# Altium schematic sheet 1_Sheet_1 copy.schdoc
size 302 x 215 mm; Name: A_A4; Symbol: A_A4; Device: A_A4; @Project Name: BackupProjects_chlehmann_personal_0_20260513; REV: 1.0; Date: 2026-05-11; Sheet: 1/1; Draw By: chlehmann; Company: Your Company; Convert to PCB: yes; Add into BOM: yes; spicePre: .; @Page No: 1; @Page Count: 2; @Schematic Name: Klettie_2026 Pro; @Board Name: Klettie_2026 Pro; @Update Date: 2026-05-13; @Create Time: 10:46:50; @Update Time: 19:20:12; @Page Name: Sheet_1 copy; @Create Date: 2026-05-13
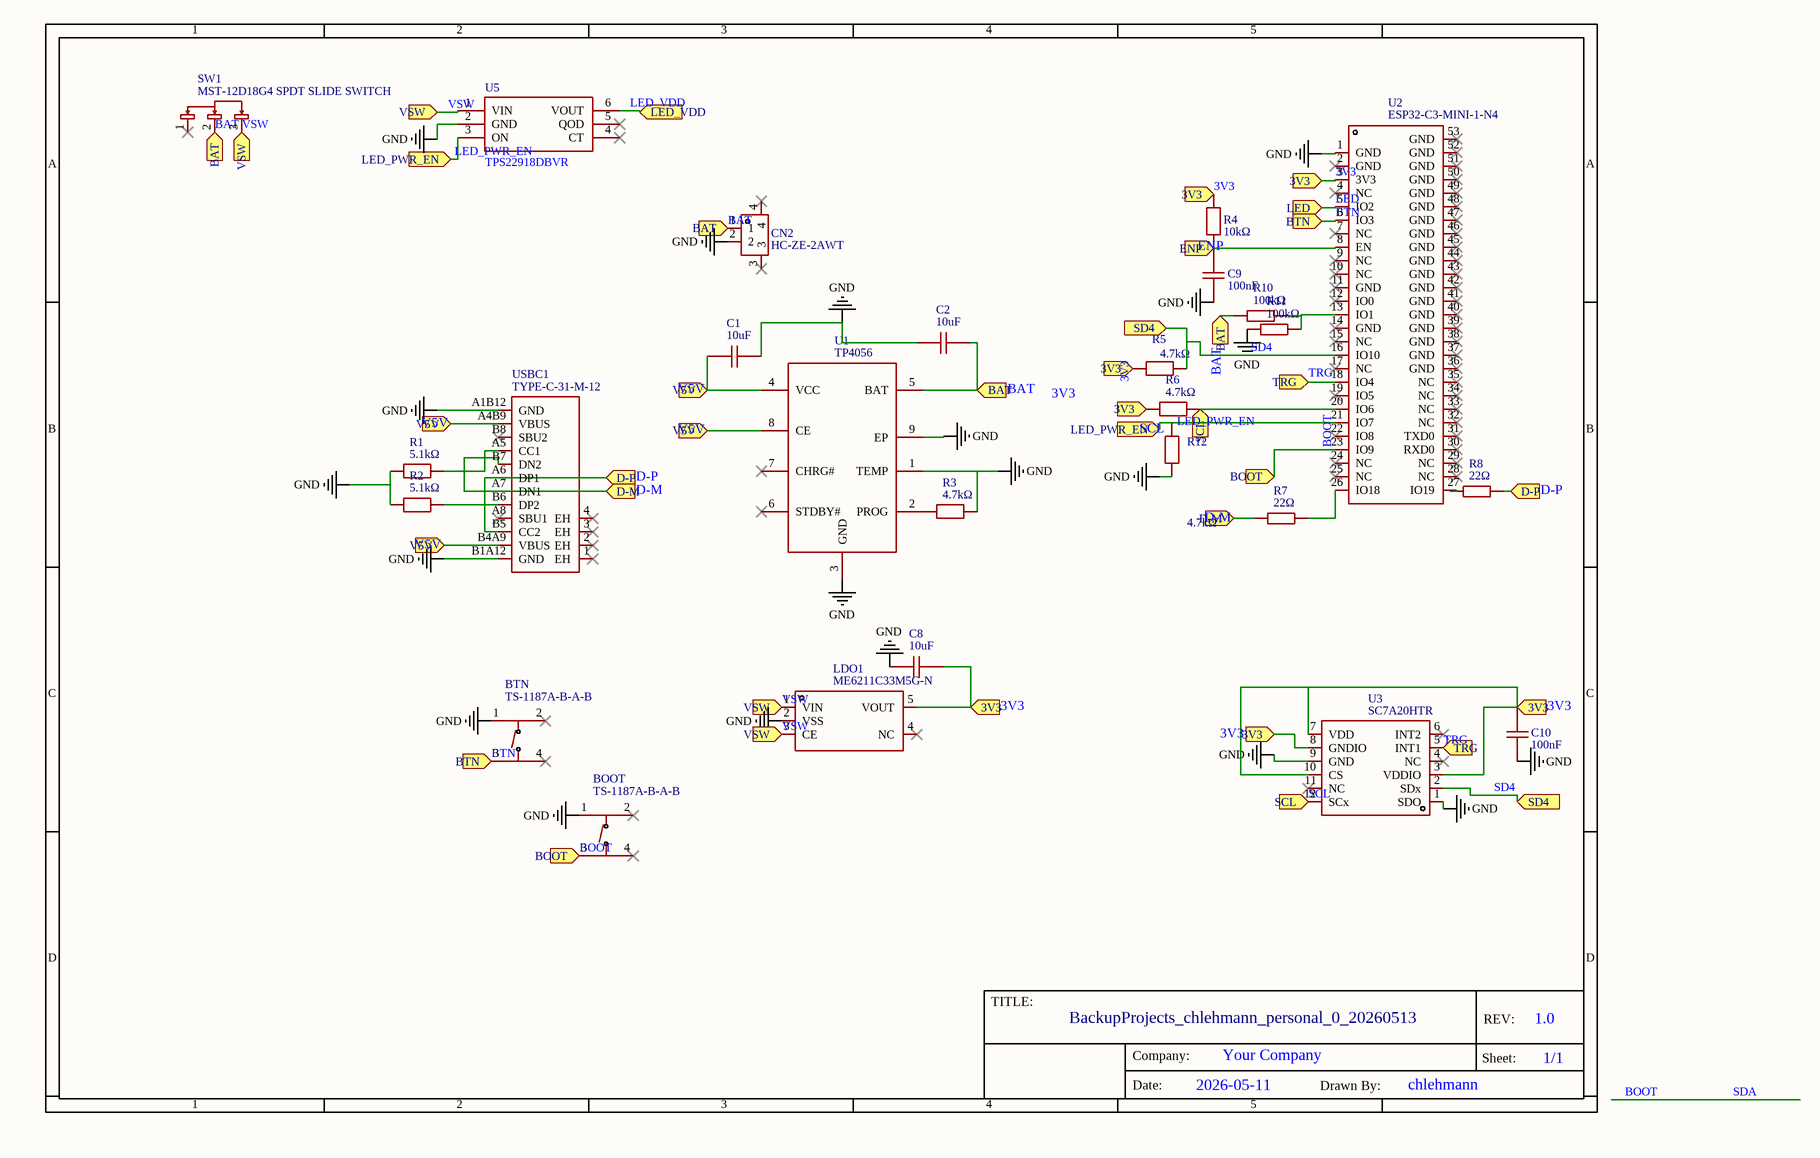
[diagram p0: 1_Sheet_1 copy.schdoc]

## Parts
BOOT  TS-1187A-B-A-B  [SW-SMD_4P-L5.1-W5.1-P3.70-LS6.5-TL_H1.5]
BTN  TS-1187A-B-A-B  [SW-SMD_4P-L5.1-W5.1-P3.70-LS6.5-TL_H1.5]
C1  10uF  [C0603]
C2  10uF  [C0603]
C8  10uF  [C0603]
C9  100nF  [C0603]
C10  100nF  [C0603]
CN2  HC-ZE-2AWT  [CONN-SMD_2P-P1.50_JST_SM02B-ZESS-TB]
LDO1  ME6211C33M5G-N  [SOT-23-5_L3.0-W1.7-P0.95-LS2.8-BL]
R1  5.1kΩ  [R0603]
R2  5.1kΩ  [R0603]
R3  4.7kΩ  [R0603]
R4  10kΩ  [R0603]
R5  4.7kΩ  [R0603]
R6  4.7kΩ  [R0603]
R7  22Ω  [R0603]
R8  22Ω  [R0603]
R10  100kΩ  [R0603]
R11  100kΩ  [R0603]
R12  4.7kΩ  [R0603]
SW1  MST-12D18G4 SPDT SLIDE SWITCH  [SW-SMD_MST-12D18G4-SPDT-SLIDE-SWITCH]
U1  TP4056  [ESOP-8_L4.9-W3.9-P1.27-LS6.0-BL-EP]
U2  ESP32-C3-MINI-1-N4  [WIFIM-SMD_ESP32-C3-MINI-1]
U3  SC7A20HTR  [LGA-12_L2.0-W2.0-P0.50-TL]
U5  TPS22918DBVR  [SOT-23-6_L2.9-W1.6-P0.95-LS2.8-BR]
USBC1  TYPE-C-31-M-12  [USB-C_SMD-TYPE-C-31-M-12_1]

## Ports
3V3 (in), BAT (in), BOOT (in), BTN (in), D-M (in), D-P (in), ENP (in), LED (in), LED_PWR_EN (in), LED_VDD (in), SCL (in), SD4 (in), TRG (in), V5V (in), VSW (in)

## Nets
GND: BOOT.1(A) BTN.1(A) C1.2 C2.1 C8.1 C9.1 C10.1 CN2.2 LDO1.2(VSS) R1.1 R2.1 R3.2 R11.1 R12.1 U1.1(TEMP) U1.3(GND) U1.9(EP) U2.1(GND) U3.1(SDO) U3.9(GND) U5.2(GND) USBC1.A1B12(GND) USBC1.B1A12(GND)
3V3: C8.2 C10.2 LDO1.5(VOUT) R4.2 R5.1 R6.1 U2.3(3V3) U3.3(VDDIO) U3.7(VDD) U3.8(GNDIO) U3.10(CS) ; port 3V3
BAT: C2.2 CN2.1 R10.1 SW1.2 U1.5(BAT) ; port BAT
BOOT: BOOT.3(C) U2.23(IO9) ; port BOOT  [also labelled SDA]
BTN: BTN.3(C) U2.6(IO3) ; port BTN
D-M: R7.1 USBC1.A7(DN1) USBC1.B7(DN2) ; port D-M
D-P: R2.2 R8.2 USBC1.A6(DP1) USBC1.B5(CC2) USBC1.B6(DP2) ; port D-P
ENP: C9.2 R4.1 U2.8(EN) ; port ENP
LED: U2.5(IO2) ; port LED
LED_PWR_EN: R12.2 U2.21(IO7) U5.3(ON) ; port LED_PWR_EN
LED_VDD: U5.6(VOUT) ; port LED_VDD
SCL: R6.2 U2.20(IO6) U3.12(SCx) ; port SCL
SD4: R5.2 U2.16(IO10) U3.2(SDx) ; port SD4
TRG: U2.18(IO4) U3.5(INT1) ; port TRG
V5V: C1.1 U1.4(VCC) U1.8(CE) USBC1.A4B9(VBUS) USBC1.B4A9(VBUS) ; port V5V
VSW: LDO1.1(VIN) LDO1.3(CE) SW1.3 U5.1(VIN) ; port VSW
NetR1_2: R1.2 USBC1.A5(CC1)
NetR3_1: R3.1 U1.2(PROG)
NetR7_2: R7.2 U2.26(IO18)
NetR8_1: R8.1 U2.27(IO19)
NetR10_2: R10.2 R11.2 U2.13(IO1)

Not connected (* = marked no-connect by the designer): BOOT 2(B)* 4(D)*; BTN 2(B)* 4(D)*; CN2 3* 4*; LDO1 4(NC)*; SW1 1*; U1 6(STDBY#)* 7(CHRG#)*; U2 2(GND)* 4(NC)* 7(NC)* 9(NC)* 10(NC)* 11(GND)* 12(IO0)* 14(GND)* 15(NC)* 17(NC)* 19(IO5)* 22(IO8)* 24(NC)* 25(NC)* 28(NC)* 29(NC)* 30(RXD0)* 31(TXD0)* 32(NC)* 33(NC)* 34(NC)* 35(NC)* 36(GND)* 37(GND)* 38(GND)* 39(GND)* 40(GND)* 41(GND)* 42(GND)* 43(GND)* 44(GND)* 45(GND)* 46(GND)* 47(GND)* 48(GND)* 49(GND)* 50(GND)* 51(GND)* 52(GND)* 53(GND)*; U3 4(NC)* 6(INT2)* 11(NC)*; U5 4(CT)* 5(QOD)*; USBC1 1(EH)* 2(EH)* 3(EH)* 4(EH)* A8(SBU1)* B8(SBU2)*

## Notes on the sheet
- Labels drawn without touching a wire or pin: 3V3, BAT, BOOT, D-M, D-P, ENP, LED_PWR_EN, SCL, TRG, V5V
- 1
- 2
- 3
- 4
- 5
- A
- B
- C
- D
- TITLE:
- BackupProjects_chlehmann_personal_0_20260513
- REV:
- 1.0
- Date:
- Company:
- 2026-05-11
- Your Company
- Drawn By:
- chlehmann
- Sheet:
- 1/1

## Library data of the parts
BOOT BTN = TS-1187A-B-A-B: Manufacturer: XKB Connection(中国星坤); Convert to PCB: yes; Contributor: LCSC; Symbol: TS-1187A-B-A-B; Device: TS-1187A-B-A-B; Supplier: LCSC; Supplier Part: C318884; Manufacturer Part: TS-1187A-B-A-B; JLCPCB Part Class: Basic Part; Add into BOM: yes; Origin Footprint: SW-SMD_4P-L5.1-W5.1-P3.70-LS6.5-TL_H1.5; spicePre: S; spiceSymbolName: TS-1187A-B-A-B
C1 C2 C8 = 10uF: Manufacturer: Chinocera(华瓷); Manufacturer Part: HGC0603R5106M250NTHJ; Convert to PCB: yes; nameAlias: Value; Contributor: lcsc; Symbol: 10uF; Device: 10uF; Supplier: LCSC; Supplier Part: C7472961; JLCPCB Part Class: Extended Part; Add into BOM: yes; Origin Footprint: C0603; spicePre: C; spiceSymbolName: HGC0603R5106M250NTHJ
C9 C10 = 100nF: Manufacturer: HRE(芯声); Manufacturer Part: CGA0603X7R104K250JT; Convert to PCB: yes; nameAlias: Value; Contributor: lcsc; Symbol: 100nF; Device: 100nF; Supplier: LCSC; Supplier Part: C6119861; JLCPCB Part Class: Extended Part; Add into BOM: yes; Origin Footprint: C0603; spicePre: C; spiceSymbolName: CGA0603X7R104K250JT
CN2 = HC-ZE-2AWT: Manufacturer: HCTL(华灿天禄); Convert to PCB: yes; Contributor: lcsc; Symbol: HC-ZE-2AWT; Device: HC-ZE-2AWT; Supplier: LCSC; Supplier Part: C5196923; Manufacturer Part: HC-ZE-2AWT; JLCPCB Part Class: Extended Part; Add into BOM: yes; Origin Footprint: CONN-SMD_2P-P1.50_JST_SM02B-ZESS-TB; spicePre: C; spiceSymbolName: HC-ZE-2AWT
LDO1 = ME6211C33M5G-N: Manufacturer: MICRONE(南京微盟); Convert to PCB: yes; Symbol: ME6211C33M5G-N; Device: ME6211C33M5G-N; Supplier: LCSC; Manufacturer Part: ME6211C33M5G-N; Supplier Part: C82942; JLCPCB Part Class: Extended Part; Add into BOM: yes; Origin Footprint: SOT-23-5_L3.0-W1.7-P0.95-LS2.8-BL; spicePre: L; spiceSymbolName: ME6211C33M5G-N
R1 R2 = 5.1kΩ: Manufacturer: YAGEO(国巨); Manufacturer Part: AT0603BRD075K1L; Convert to PCB: yes; Contributor: LCSC; nameAlias: Value; Symbol: 5.1kΩ; Device: 5.1kΩ; Supplier: LCSC; Supplier Part: C914801; JLCPCB Part Class: Extended Part; Add into BOM: yes; Origin Footprint: R0603; spicePre: R; spiceSymbolName: AT0603BRD075K1L
R3 R5 R6 R12 = 4.7kΩ: Manufacturer: YAGEO(国巨); Manufacturer Part: AT0603BRD074K7L; Convert to PCB: yes; nameAlias: Value; Contributor: lcsc; Symbol: 4.7kΩ; Device: 4.7kΩ; Supplier: LCSC; Supplier Part: C855887; JLCPCB Part Class: Extended Part; Add into BOM: yes; Origin Footprint: R0603; spicePre: R; spiceSymbolName: AT0603BRD074K7L
R4 = 10kΩ: Manufacturer: YAGEO(国巨); Manufacturer Part: AT0603BRD0710KL; Convert to PCB: yes; Contributor: LCSC; nameAlias: Value; Symbol: 10kΩ; Device: 10kΩ; Supplier: LCSC; Supplier Part: C723396; JLCPCB Part Class: Extended Part; Add into BOM: yes; Origin Footprint: R0603; spicePre: R; spiceSymbolName: AT0603BRD0710KL
R7 R8 = 22Ω: Manufacturer: VISHAY(威世); Manufacturer Part: CRCW060322R0FKEA; Convert to PCB: yes; nameAlias: Value; Contributor: LCSC; Symbol: 22Ω; Device: 22Ω; Supplier: LCSC; Supplier Part: C71618; JLCPCB Part Class: Extended Part; Add into BOM: yes; Origin Footprint: R0603; spicePre: R; spiceSymbolName: CRCW060322R0FKEA
R10 R11 = 100kΩ: Manufacturer: YAGEO(国巨); Manufacturer Part: RT0603DRE07100KL; Convert to PCB: yes; nameAlias: Value; Contributor: LCSC; Symbol: 100kΩ; Device: 100kΩ; Supplier: LCSC; Supplier Part: C327122; JLCPCB Part Class: Extended Part; Add into BOM: yes; Origin Footprint: R0603; spicePre: R; spiceSymbolName: RT0603DRE07100KL
SW1 = MST-12D18G4 SPDT SLIDE SWITCH: Manufacturer: SHOU HAN(首韩); Convert to PCB: yes; Contributor: lcsc; Symbol: MST-12D18G4 SPDT SLIDE SWITCH; Device: MST-12D18G4 SPDT SLIDE SWITCH; Supplier: LCSC; Supplier Part: C49023767; Manufacturer Part: MST-12D18G4 SPDT Slide Switch; JLCPCB Part Class: Extended Part; Add into BOM: yes; Origin Footprint: SW-SMD_MST-12D18G4-SPDT-SLIDE-SWITCH; spicePre: S; spiceSymbolName: MST-12D18G4 SPDT SLIDE SWITCH
U1 = TP4056: Manufacturer: TOPPOWER(南京拓微); Manufacturer Part: TP4056-42-ESOP8; Convert to PCB: yes; Contributor: Guest; Symbol: TP4056; Device: TP4056; Supplier: LCSC; Supplier Part: C16581; JLCPCB Part Class: Extended Part; Add into BOM: yes; Origin Footprint: ESOP-8_L4.9-W3.9-P1.27-LS6.0-BL-EP; spicePre: U; spiceSymbolName: TP4056
U2 = ESP32-C3-MINI-1-N4: Manufacturer: ESPRESSIF(乐鑫); Convert to PCB: yes; Contributor: LCSC; Symbol: ESP32-C3-MINI-1-N4; Device: ESP32-C3-MINI-1-N4; Supplier: LCSC; Supplier Part: C2838502; Manufacturer Part: ESP32-C3-MINI-1-N4; JLCPCB Part Class: Extended Part; Add into BOM: yes; Origin Footprint: WIFIM-SMD_ESP32-C3-MINI-1; spicePre: U; spiceSymbolName: ESP32-C3-MINI-1-N4
U3 = SC7A20HTR: Manufacturer: SILAN(士兰微); Convert to PCB: yes; Contributor: lcsc; Symbol: SC7A20HTR; Device: SC7A20HTR; Supplier: LCSC; Supplier Part: C19274408; Manufacturer Part: SC7A20HTR; JLCPCB Part Class: Extended Part; Add into BOM: yes; Origin Footprint: LGA-12_L2.0-W2.0-P0.50-TL; spicePre: U; spiceSymbolName: SC7A20HTR
U5 = TPS22918DBVR: Manufacturer: TI(德州仪器); Add into BOM: yes; Number of Channels: 1; Control Input Logic: Active High; Voltage - Supply: 1V~5.5V; Maximum Continuous Current: 2A; RDS(on): 53mΩ; Symbol: TPS22918DBVR; Device: TPS22918DBVR; LCSC Part Name: 5.5V、2A、导通电阻的负载开关; Supplier Part: C131941; Manufacturer Part: TPS22918DBVR; Supplier Footprint: SOT-23-6; JLCPCB Part Class: Extended Part; Datasheet: https://www.ti.com/cn/lit/gpn/tps22918; Supplier: LCSC; Convert to PCB: yes; Type: Load Switch; Features: Integrated charge pump；Output discharge function；Soft-start; Operating Temperature	-: -40℃~+105℃
USBC1 = TYPE-C-31-M-12: Manufacturer: 韩国韩荣; Convert to PCB: yes; Contributor: LCSC; Symbol: TYPE-C-31-M-12; Device: TYPE-C-31-M-12; Supplier: LCSC; Supplier Part: C165948; Manufacturer Part: TYPE-C-31-M-12; JLCPCB Part Class: Extended Part; Add into BOM: yes; Origin Footprint: USB-C_SMD-TYPE-C-31-M-12_1; spicePre: U; spiceSymbolName: TYPE-C-31-M-12